# Altium project Air quality sensor.PrjPcb
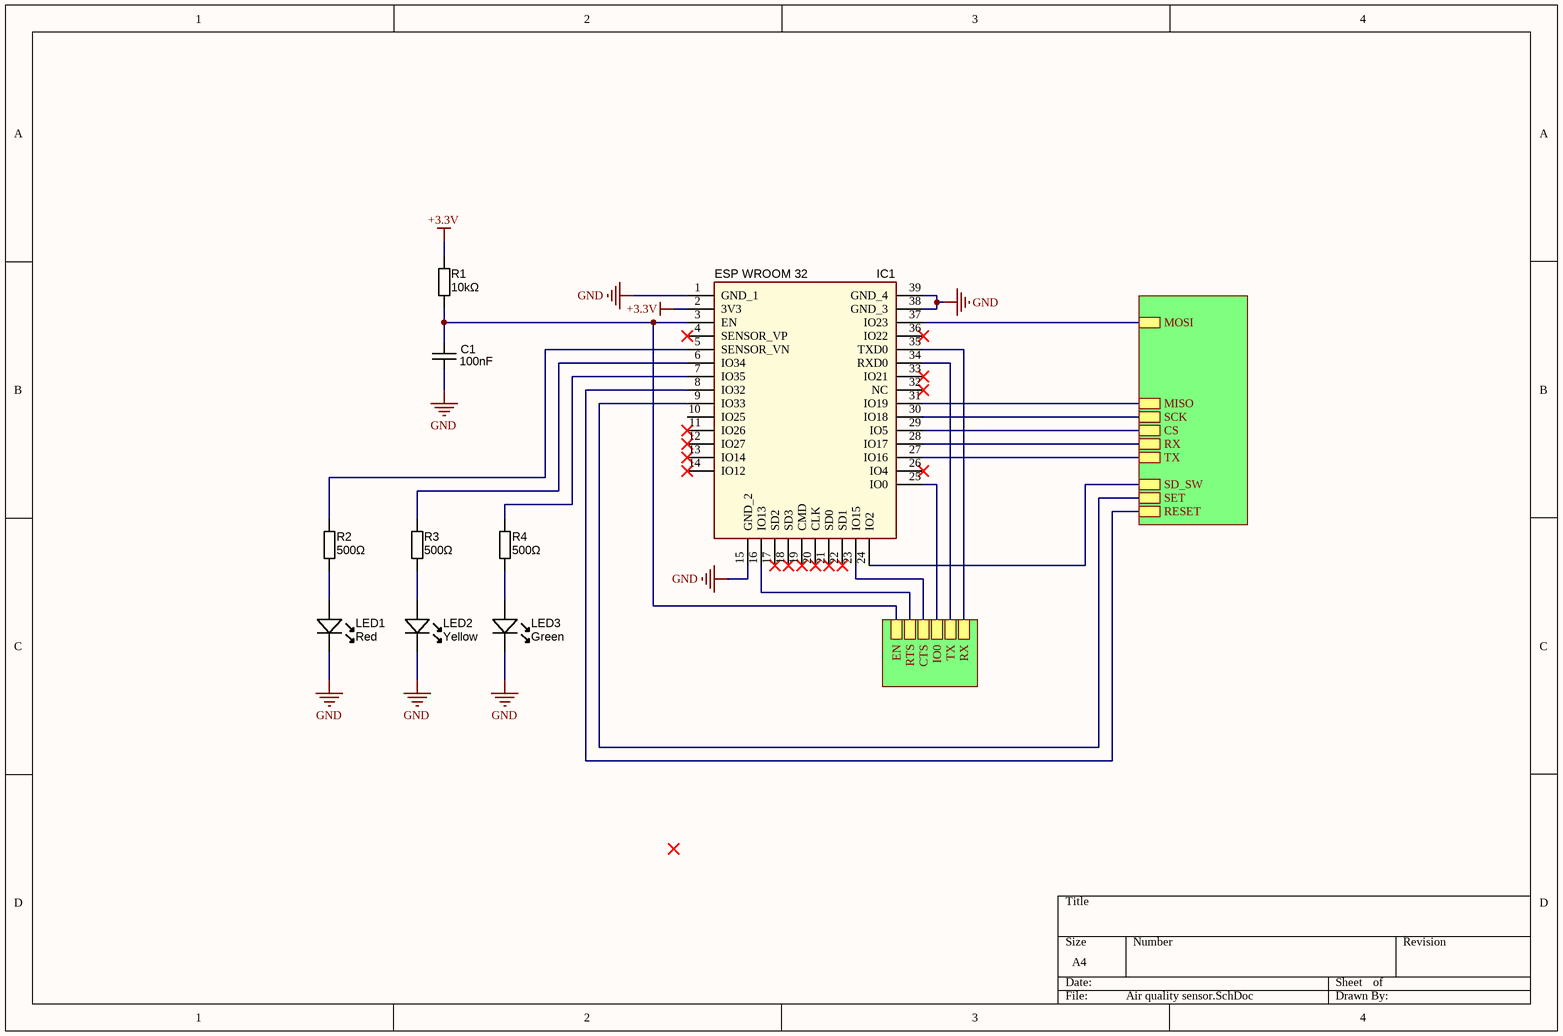
[diagram p0: Air quality sensor.SchDoc]
4 sheets, 50 parts. Net scope: hierarchical (ports join the sheet entries above them; power ports are global).
Board file: Air quality sensor.PcbDoc
Sheets:
  Air quality sensor.SchDoc
    U_USB module = USB module.SchDoc
    U_Power managment = Power managment.SchDoc
    U_Air sensor, SD card = Air sensor, SD card.SchDoc

## Sheet Air quality sensor.SchDoc
size A4

### Parts
C1  value 100nF  [CAPC1608N]  (hidden comment: approved sub OK)
IC1  ESP WROOM 32  [ESP32WROOM32D]
LED1  Red  [LED-0603-WHITE]
LED2  Yellow  [LED-0603-WHITE]
LED3  Green  [LED-0603-WHITE]
R1  value 10kΩ  [RESC1608N]  (hidden comment: Thick Film)
R2  value 500Ω  [RESC1608N]  (hidden comment: Thick Film)
R3  value 500Ω  [RESC1608N]  (hidden comment: Thick Film)
R4  value 500Ω  [RESC1608N]  (hidden comment: Thick Film)

### Sub-sheets
U_Air sensor, SD card = Air sensor, SD card.SchDoc: SD_SW, MISO, SCK, MOSI, CS, RX, TX, SET, RESET
U_Power managment = Power managment.SchDoc: no entries
U_USB module = USB module.SchDoc: CTS, IO0, RTS, TX, RX, EN

### Nets
+3.3V: IC1.2(3V3) R1.1
GND: C1.1 IC1.1(GND_1) IC1.15(GND_2) IC1.38(GND_3) IC1.39(GND_4) LED1.K LED2.K LED3.K
NetC1_2: C1.2 IC1.3(EN) R1.2 ; sheet U_USB module/EN
NetCON2_2: IC1.29(IO5) ; sheet U_Air sensor, SD card/CS
NetCON2_3: IC1.37(IO23) ; sheet U_Air sensor, SD card/MOSI
NetCON2_5: IC1.30(IO18) ; sheet U_Air sensor, SD card/SCK
NetCON2_7: IC1.31(IO19) ; sheet U_Air sensor, SD card/MISO
NetIC1_5: IC1.5(SENSOR_VN) R2.1
NetIC1_6: IC1.6(IO34) R3.1
NetIC1_7: IC1.7(IO35) R4.1
NetIC1_8: IC1.8(IO32) ; sheet U_Air sensor, SD card/RESET
NetIC1_9: IC1.9(IO33) ; sheet U_Air sensor, SD card/SET
NetIC1_16: IC1.16(IO13) ; sheet U_USB module/RTS
NetIC1_23: IC1.23(IO15) ; sheet U_USB module/CTS
NetIC1_24: IC1.24(IO2) ; sheet U_Air sensor, SD card/SD_SW
NetIC1_25: IC1.25(IO0) ; sheet U_USB module/IO0
NetIC1_27: IC1.27(IO16) ; sheet U_Air sensor, SD card/TX
NetIC1_28: IC1.28(IO17) ; sheet U_Air sensor, SD card/RX
NetIC1_34: IC1.34(RXD0) ; sheet U_USB module/TX
NetIC1_35: IC1.35(TXD0) ; sheet U_USB module/RX
NetLED1_A: LED1.A R2.2
NetLED2_A: LED2.A R3.2
NetLED3_A: LED3.A R4.2

Not connected (* = marked no-connect by the designer): IC1 4(SENSOR_VP)* 10(IO25) 11(IO26)* 12(IO27)* 13(IO14)* 14(IO12)* 17(SD2)* 18(SD3)* 19(CMD)* 20(CLK)* 21(SD0)* 22(SD1)* 26(IO4)* 32(NC)* 33(IO21)* 36(IO22)*

### Library data of the parts
C1 = CAPC_1u_0603: Capacitor SMD Cer 1uF 10% 16V X7R 0603; Manufacturer 1: TDK Corporation; Manufacturer Part Number 1: C1608X7R1C105K; Ratings: 16V; X7R; Material: ceramic; Package / Case: 0603 (1608 metric); Tolerance: ±10%; Supplier 1: Digi-Key; Supplier Part Number 1: 445-1604-1-ND
IC1 = ESP-WROOM-32__16MB_: Integrated Circuit; Manufacturer_Name: Espressif; Manufacturer_Part_Number: ESP-WROOM-32 (16MB); Datasheet Link: https://www.mouser.com/datasheet/2/891/esp-wroom-32_datasheet_en-1365813.pdf; Height: 3.1mm; Mouser Part Number: 356-ESPWROOM3216MB
LED1-LED3 = LED_SMD_White_0603_109mcd: LED 0603 SMD White 8700K 108.5mcd 5mA; Manufacturer 1: Lite-On Inc; Manufacturer Part Number 1: LTW-C193TS5; Material: InGaN; Ratings: 108.5 mcd; 8700K; Millicandela Rating: 230mcd; Voltage - Forward (Vf) Typ: 3.3V; Current - Test: 20mA; Viewing Angle: 120°; Lens Type: Clear, Tinted; Lens Style/Size: Rectangle with Flat Top, 0.8mm x 1.1mm; Voltage - Forward (Vf) @ 10mA: 3.0V; Package / Case: 0603 (1608 metric); Supplier 1: Digi-Key; Supplier Part Number 1: 160-1721-1-ND; Supplier 2: Digi-Key; Supplier Part Number 2: APT1608QWF/D-ND; Manufacturer 2: Kingbright Corp; Manufacturer Part Number 2: APT1608QWF/D; Color: White; Size / Dimension: 1.60mm L x 0.80mm W; Mounting Type: Surface Mount; Luminous Flux @ Current - Test: -; ComponentLink2URL: http://www.kingbrightusa.com/images/catalog/SPEC/APT1608QWF-D.pdf; ComponentLink2Description: APT1608QWF-D Datasheet
R1-R4 = RES_1K5_0603_5%: Resistor SMD chip 1.5k Ohm 0.1W 5% 0603; Manufacturer 1: Yageo; Manufacturer Part Number 1: RC0603JR-071K5L; Ratings: 1/10 W; Package / Case: 0603 (1608 metric); Tolerance: ±5%; Material: thick film; Supplier 1: Digi-Key; Supplier Part Number 1: 311-1.5KGRCT-ND

## Sheet USB module.SchDoc
size A4; Organization: Altium Limited; Address1: L3, 12a Rodborough Rd; Address2: Frenchs Forest; Address3: NSW; Address4: Australia 2086
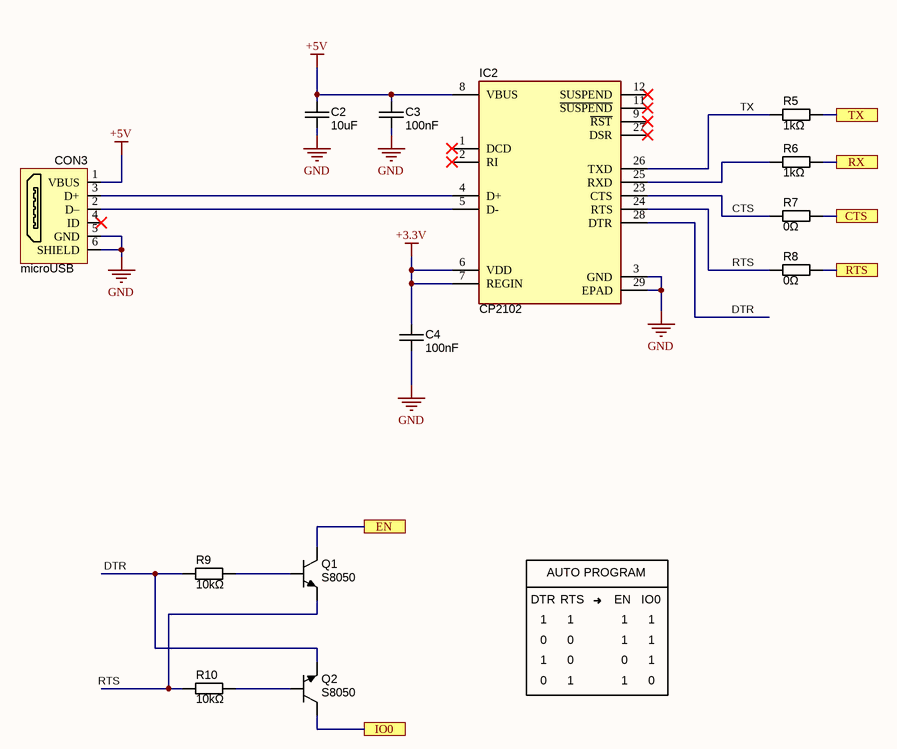
[diagram p1: USB module.SchDoc]

### Parts
C2  value 10uF  [CAPC1608N]  (hidden comment: approved sub OK)
C3  value 100nF  [CAPC1608N]  (hidden comment: approved sub OK)
C4  value 100nF  [CAPC1608N]  (hidden comment: approved sub OK)
CON3  microUSB  [micro-USB-HRS-ZX62D-B-5PA8]
IC2  CP2102  [QFN50P500X500X100-29N-D]
Q1  Manufacturer Part Number 1: S8050  [SOT23-3]  (hidden comment: NPN_S8050)
Q2  Manufacturer Part Number 1: S8050  [SOT23-3]  (hidden comment: NPN_S8050)
R5  value 1kΩ  [RESC1608N]  (hidden comment: Thick Film)
R6  value 1kΩ  [RESC1608N]  (hidden comment: Thick Film)
R7  value 0Ω  [RESC1608N]  (hidden comment: Thick Film)
R8  value 0Ω  [RESC1608N]  (hidden comment: Thick Film)
R9  value 10kΩ  [RESC1608N]  (hidden comment: Thick Film)
R10  value 10kΩ  [RESC1608N]  (hidden comment: Thick Film)

### Ports
CTS, EN, IO0, RTS, RX, TX

### Nets
+3.3V: C4.2 IC2.6(VDD) IC2.7(REGIN)
+5V: C2.2 C3.2 CON3.1(VBUS) IC2.8(VBUS)
GND: C2.1 C3.1 C4.1 CON3.5(GND) CON3.6(SHIELD) IC2.3(GND) IC2.29(EPAD)
CTS: IC2.23(CTS) R7.2
DTR: IC2.28(DTR) Q2.2(E) R9.2
RTS: IC2.24(RTS) Q1.2(E) R8.2 R10.2
TX: IC2.26(TXD) R5.2
NetC1_2: Q1.3(C) ; port EN
NetCON3_2: CON3.2(D–) IC2.5(D-)
NetCON3_3: CON3.3(D+) IC2.4(D+)
NetIC1_16: R8.1 ; port RTS
NetIC1_23: R7.1 ; port CTS
NetIC1_25: Q2.3(C) ; port IO0
NetIC1_34: R5.1 ; port TX
NetIC1_35: R6.1 ; port RX
NetIC2_25: IC2.25(RXD) R6.2
NetQ1_1: Q1.1(B) R9.1
NetQ2_1: Q2.1(B) R10.1

Not connected (* = marked no-connect by the designer): CON3 4(ID)*; IC2 1(DCD)* 2(RI)* 9(~{RST})* 11(~{SUSPEND})* 12(SUSPEND)* 27(DSR)*

### Notes on the sheet
- DTR
- 1
- AUTO PROGRAM
- RTS
- EN
- IO0
- 0
- Title
- Size:
- Date:
- A4
- Number:
- Time:
- Revision:
- Sheet
- of
- File:

### Library data of the parts
C2-C4 = CAPC_1u_0603: as C1 on sheet Air quality sensor; Package / Case: 0603 (1608 metric); Tolerance: ±10%; Supplier 1: Digi-Key; Supplier Part Number 1: 445-1604-1-ND
CON3 = microUSB-B-socket (HIROSE ZX62D-B-5PA8): micro USB-B socket (HIROSE ZX62D-B-5PA8); pin to pad: 6>0; Supplier 1: Farnell; ComponentLink1URL: http://www.farnell.com/datasheets/1693470.pdf; ComponentLink1Description: http://www.farnell.com/datasheets/1693470.pdf; Supplier Part Number 1: 2300438
IC2 = CP2102: Integrated Circuit; Manufacturer_Name: Silicon Labs; Datasheet Link: https://componentsearchengine.com/Datasheets/1/CP2102.pdf; Height: 1mm; Manufacturer_Part_Number: CP2102; Mouser Part Number: 634-CP2102; Mouser Price/Stock: https://www.mouser.co.uk/ProductDetail/Silicon-Labs/CP2102?qs=ucY0lxHzU7615lOm95XT0w%3D%3D
Q1 Q2 = NPN_S8050: Transistor SMD NPN 40V 0.2A 350mW SOT-23; Manufacturer 1: Fairchild Semiconductor; Ratings: 40V; 200mA; 350mW; Material: Si; Package / Case: SOT-23; Supplier 1: Digi-Key; Supplier Part Number 1: MMBT3904FSCT-ND; Transistor Type: NPN; Mounting Type: Surface Mount
R5-R10 = RES_1K5_0603_5%: as R1 on sheet Air quality sensor; Package / Case: 0603 (1608 metric); Tolerance: ±5%; Material: thick film; Supplier 1: Digi-Key; Supplier Part Number 1: 311-1.5KGRCT-ND

## Sheet Power managment.SchDoc
size A4; Organization: Altium Limited; Address1: L3, 12a Rodborough Rd; Address2: Frenchs Forest; Address3: NSW; Address4: Australia 2086
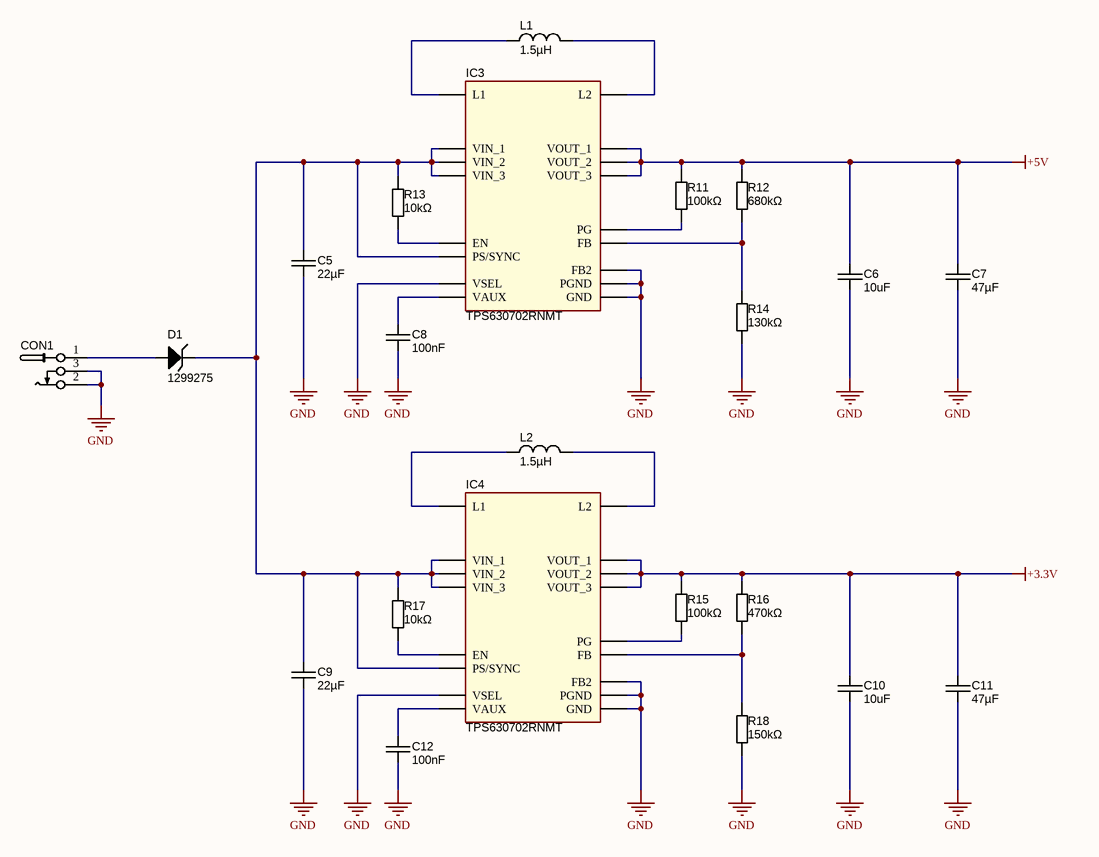
[diagram p2: Power managment.SchDoc]

### Parts
C5  value 22µF  [CAPC3216N]  (hidden comment: approved sub OK)
C6  value 10uF  [CAPC1608N]  (hidden comment: approved sub OK)
C7  value 47µF  [CAPC3216N]  (hidden comment: approved sub OK)
C8  value 100nF  [CAPC1608N]  (hidden comment: approved sub OK)
C9  value 22µF  [CAPC3216N]  (hidden comment: approved sub OK)
C10  value 10uF  [CAPC1608N]  (hidden comment: approved sub OK)
C11  value 47µF  [CAPC3216N]  (hidden comment: approved sub OK)
C12  value 100nF  [CAPC1608N]  (hidden comment: approved sub OK)
CON1  12V  [FC68148S_2]  (value not drawn)
D1  Supplier Part Number 1: 1299275  [DO-214AC_Unidirectional]  (hidden comment: Unidirectional, 400 W, 100 VDC)
IC3  TPS630702RNMT  [TPS630702RNMT]
IC4  TPS630702RNMT  [TPS630702RNMT]
L1  1.5µH  [INDPM6965X300N]
L2  1.5µH  [INDPM6965X300N]
R11  value 100kΩ  [RESC1608N]  (hidden comment: Thick Film)
R12  value 680kΩ  [RESC1608N]  (hidden comment: Thick Film)
R13  value 10kΩ  [RESC1608N]  (hidden comment: Thick Film)
R14  value 130kΩ  [RESC1608N]  (hidden comment: Thick Film)
R15  value 100kΩ  [RESC1608N]  (hidden comment: Thick Film)
R16  value 470kΩ  [RESC1608N]  (hidden comment: Thick Film)
R17  value 10kΩ  [RESC1608N]  (hidden comment: Thick Film)
R18  value 150kΩ  [RESC1608N]  (hidden comment: Thick Film)

### Nets
+3.3V: C10.2 C11.1 IC4.7(VOUT_1) IC4.8(VOUT_2) IC4.A7(VOUT_3) R15.2 R16.2
+5V: C6.2 C7.1 IC3.7(VOUT_1) IC3.8(VOUT_2) IC3.A7(VOUT_3) R11.2 R12.2
GND: C5.2 C6.1 C7.2 C8.1 C9.2 C10.1 C11.2 C12.1 CON1.2 CON1.3 IC3.4(GND) IC3.6(FB2) IC3.10(PGND) IC3.15(VSEL) IC4.4(GND) IC4.6(FB2) IC4.10(PGND) IC4.15(VSEL) R14.1 R18.1
NetC5_1: C5.1 C9.1 D1.1 IC3.1(PS/SYNC) IC3.12(VIN_1) IC3.13(VIN_2) IC3.A12(VIN_3) IC4.1(PS/SYNC) IC4.12(VIN_1) IC4.13(VIN_2) IC4.A12(VIN_3) R13.2 R17.2
NetC8_2: C8.2 IC3.3(VAUX)
NetC12_2: C12.2 IC4.3(VAUX)
NetCON1_1: CON1.1 D1.2
NetIC3_2: IC3.2(PG) R11.1
NetIC3_5: IC3.5(FB) R12.1 R14.2
NetIC3_9: IC3.9(L2) L1.2
NetIC3_11: IC3.11(L1) L1.1
NetIC3_14: IC3.14(EN) R13.1
NetIC4_2: IC4.2(PG) R15.1
NetIC4_5: IC4.5(FB) R16.1 R18.2
NetIC4_9: IC4.9(L2) L2.2
NetIC4_11: IC4.11(L1) L2.1
NetIC4_14: IC4.14(EN) R17.1

### Notes on the sheet
- Title
- Size:
- Date:
- A4
- Number:
- Time:
- Revision:
- Sheet
- of
- File:

### Library data of the parts
C5 C7 C9 C11 = CAPC_10u_1206_16V: Capacitor SMD Cer 10uF 10% 16V X7R 1206; Manufacturer 1: Kemet; Manufacturer Part Number 1: C1206C106K4RACTU; Ratings: 16V; X7R; Material: ceramic; Package / Case: 1206 (3216 metric); Tolerance: ±10%; Supplier 1: Digi-Key; Supplier Part Number 1: 399-3525-1-ND
C6 C8 C10 C12 = CAPC_1u_0603: as C1 on sheet Air quality sensor; Package / Case: 0603 (1608 metric); Tolerance: ±10%; Supplier 1: Digi-Key; Supplier Part Number 1: 445-1604-1-ND
CON1 = CONN_PWR_JACK_2.1x5.5mm: Power Connector, THT, 2.1mm ID, 5.5mm OD; Manufacturer 1: CUI Inc; Manufacturer Part Number 1: PJ-102AH; Category: Connectors; Mounting Type: Through Hole; Package / Case: PCB mount; Value: 2.1mm ID, 5.5mm OD; Supplier 1: Digi-Key; Supplier Part Number 1: CP-102AH-ND
D1 = WE-TVSP DO-214AC, 824500102: WE-TVSP Power TVS Diode, Unidirectional, 400 W, 100 VDC; Manufacturer: Wurth Elektronik; Manufacturer Part Number: SK24A; Repetitive Reverse Voltage Vrrm Max: 40; Forward Current If(AV): 2; Diode Configuration: Single; Diode Case Style: DO-214; Forward Voltage VF Max: 500; Forward Surge Current Ifsm Max: 50; Product Range: SK Series; SVHC: No SVHC (17-Dec-2015); Diode Type: Schottky; Junction Temperature Tj Max: 125; Junction Temperature Tj Min: -65; partNo: 824500102; ComponentLink1Description: Manufacturer; ComponentLink1URL: http://www.we-online.de; Created by: Baojun Chen; Created Date: Nov.2015; ComponentLink2Description: Datasheet; ComponentLink2URL: http://katalog.we-online.de/pbs/datasheet/824500102.pdf; Supplier 1: Farnell; RoHS: YES; Stock 1: 30726; Pricing 1: 5=0.071, 100=0.0686, 250=0.0662, 1000=0.0638, 3600=0.0614, 20000=0.059, 50000=0.057, 90000=0.055 (EUR); No. of Pins: 2; Operating Temperature Max: 125; Packaging: Cut Tape; Automotive Qualification Standard: -; Alternate Case Style: DO-214; Current Ifsm: 50; Current Ir Max: 500; Forward Voltage: 500; MSL: MSL 1 - Unlimited; Operating Temperature Min: -65; Operating Temperature Range: -65°C to +125; Reverse Voltage Vr Max: 40; Termination Type: Surface Mount Device<!--FANDB--><div class="features-and-benefits-container"><div class="features-and-benefits-description"><span class="features-benefits-value">The SK24A is a surface-mount Schottky Barrier Rectifier with moulded plastic case and solder-plated terminals.</span></div><div class="features-and-benefits-list"><ul class="features-and-benefits-list-list"><li class="features-and-benefits-list-item">Polarity is indicated by cathode band</li><li class="features-and-benefits-list-item">Metal to silicon rectifier, majority carrier conduction</li><li class="features-and-benefits-list-item">Low forward voltage drop</li><li class="features-and-benefits-list-item">Easy pick and place</li><li class="features-and-benefits-list-item">High surge current capability</li><li class="features-and-benefits-list-item">UL94V-0 Flammability rating</li><li class="features-and-benefits-list-item">Epitaxial construction</li><li class="features-and-benefits-list-item">260°C/10; ComponentLink3URL: http://www.farnell.com/datasheets/51631.pdf; ComponentLink3Description: http://www.farnell.com/datasheets/51631.pdf
IC3 IC4 = TPS630702RNMT: Integrated Circuit; Manufacturer_Name: Texas Instruments; Datasheet Link: http://www.ti.com/lit/gpn/TPS63070; Height: 1mm; Manufacturer_Part_Number: TPS630702RNMT; Mouser Part Number: 595-TPS630702RNMT; Mouser Price/Stock: https://www.mouser.co.uk/ProductDetail/Texas-Instruments/TPS630702RNMT?qs=vLWxofP3U2wR9GhA3fXurw%3D%3D; Arrow Part Number: TPS630702RNMT; Arrow Price/Stock: https://www.arrow.com/en/products/tps630702rnmt/texas-instruments
L1 L2 = INDC_1.5u: Inductor SMD Low DCR 10 µH 900mA 20% 1210; Manufacturer 1: Taiyo Yuden; Manufacturer Part Number 1: CBC3225T100MR; Ratings: 900 mA; 133 mOhm; DC Resistance (DCR): 172.9 mOhm Max; Frequency - Self Resonant: 23MHz; Frequency - Test: 100kHz; Tolerance: ±20%; Supplier 1: Digi-Key; Supplier Part Number 1: 587-1625-1-ND; Current: 900mA; Current - Saturation: 900mA; Current - Temperature Rise: 900mA; Applications: Power Supplies; Package / Case: 1210 (3225 Metric); Operating Temperature: -40°C ~ 105°C; ComponentLink1URL: http://www.yuden.co.jp/ut/product/pdf/wound02_e.pdf; ComponentLink1Description: http://www.yuden.co.jp/ut/product/pdf/wound02_e.pdf; Value: 1.5µH
R11-R18 = RES_1K5_0603_5%: as R1 on sheet Air quality sensor; Package / Case: 0603 (1608 metric); Tolerance: ±5%; Material: thick film; Supplier 1: Digi-Key; Supplier Part Number 1: 311-1.5KGRCT-ND

## Sheet Air sensor, SD card.SchDoc
size A4; Organization: Altium Limited; Address1: L3, 12a Rodborough Rd; Address2: Frenchs Forest; Address3: NSW; Address4: Australia 2086
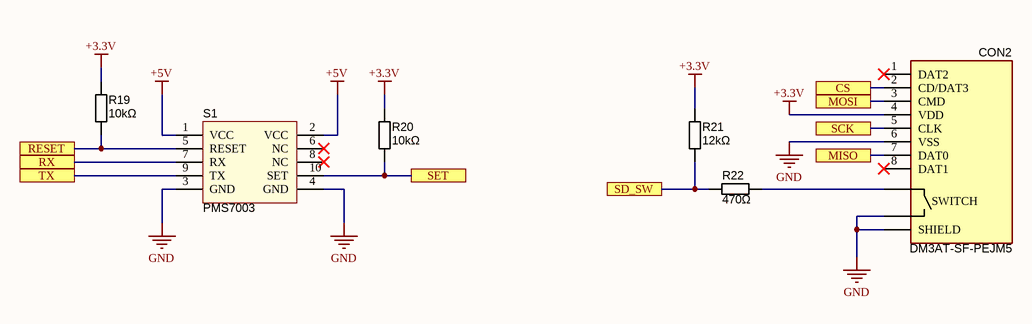
[diagram p3: Air sensor, SD card.SchDoc]

### Parts
CON2  DM3AT-SF-PEJM5  [DM3ATSFPEJM5]
R19  value 10kΩ  [RESC1608N]  (hidden comment: Thick Film)
R20  value 10kΩ  [RESC1608N]  (hidden comment: Thick Film)
R21  value 12kΩ  [RESC1608N]  (hidden comment: Thick Film)
R22  value 470Ω  [RESC1608N]  (hidden comment: Thick Film)
S1  PMS7003  [PMS7003]

### Ports
CS, MISO, MOSI, RESET, RX, SCK, SD_SW, SET, TX

### Nets
+3.3V: CON2.4(VDD) R19.2 R20.2 R21.2
+5V: S1.1(VCC) S1.2(VCC)
GND: CON2.6(VSS) CON2.10(SW_2) CON2.GND(SHIELD) S1.3(GND) S1.4(GND)
NetCON2_2: CON2.2(CD/DAT3) ; port CS
NetCON2_3: CON2.3(CMD) ; port MOSI
NetCON2_5: CON2.5(CLK) ; port SCK
NetCON2_7: CON2.7(DAT0) ; port MISO
NetCON2_9: CON2.9(SW_1) R22.1
NetIC1_8: R19.1 S1.5(RESET) ; port RESET
NetIC1_9: R20.1 S1.10(SET) ; port SET
NetIC1_24: R21.1 R22.2 ; port SD_SW
NetIC1_27: S1.9(TX) ; port TX
NetIC1_28: S1.7(RX) ; port RX

Not connected (* = marked no-connect by the designer): CON2 1(DAT2)* 8(DAT1)*; S1 6(NC)* 8(NC)*

### Notes on the sheet
- Title
- Size:
- Date:
- A4
- Number:
- Time:
- Revision:
- Sheet
- of
- File:
- (in symbol DM3AT-SF-PEJM5) SWITCH

### Library data of the parts
CON2 = DM3AT-SF-PEJM5: Connector; Manufacturer_Name: HRS(Hirose); Datasheet Link: https://datasheet.lcsc.com/szlcsc/Hirose-HRS-DM3AT-SF-PEJM5_C114218.pdf; Height: 1.83mm; Manufacturer_Part_Number: DM3AT-SF-PEJM5
R19-R22 = RES_1K5_0603_5%: as R1 on sheet Air quality sensor; Package / Case: 0603 (1608 metric); Tolerance: ±5%; Material: thick film; Supplier 1: Digi-Key; Supplier Part Number 1: 311-1.5KGRCT-ND

## Nets that join several sheets
+3.3V: Air quality sensor (IC1.2 R1.1), USB module (C4.2 IC2.6 IC2.7), Power managment (7 pins), Air sensor, SD card (CON2.4 R19.2 R20.2 R21.2)
+5V: USB module (C2.2 C3.2 CON3.1 IC2.8), Power managment (7 pins), Air sensor, SD card (S1.1 S1.2)
GND: Air quality sensor (8 pins), USB module (7 pins), Power managment (20 pins), Air sensor, SD card (5 pins)
NetC1_2: Air quality sensor (C1.2 IC1.3 R1.2), USB module (Q1.3)
NetCON2_2: Air quality sensor (IC1.29), Air sensor, SD card (CON2.2)
NetCON2_3: Air quality sensor (IC1.37), Air sensor, SD card (CON2.3)
NetCON2_5: Air quality sensor (IC1.30), Air sensor, SD card (CON2.5)
NetCON2_7: Air quality sensor (IC1.31), Air sensor, SD card (CON2.7)
NetIC1_8: Air quality sensor (IC1.8), Air sensor, SD card (R19.1 S1.5)
NetIC1_9: Air quality sensor (IC1.9), Air sensor, SD card (R20.1 S1.10)
NetIC1_16: Air quality sensor (IC1.16), USB module (R8.1)
NetIC1_23: Air quality sensor (IC1.23), USB module (R7.1)
NetIC1_24: Air quality sensor (IC1.24), Air sensor, SD card (R21.1 R22.2)
NetIC1_25: Air quality sensor (IC1.25), USB module (Q2.3)
NetIC1_27: Air quality sensor (IC1.27), Air sensor, SD card (S1.9)
NetIC1_28: Air quality sensor (IC1.28), Air sensor, SD card (S1.7)
NetIC1_34: Air quality sensor (IC1.34), USB module (R5.1)
NetIC1_35: Air quality sensor (IC1.35), USB module (R6.1)